# EAGLE schematic SAI_IO_Top_BOARD (EAGLE 9.6.2)
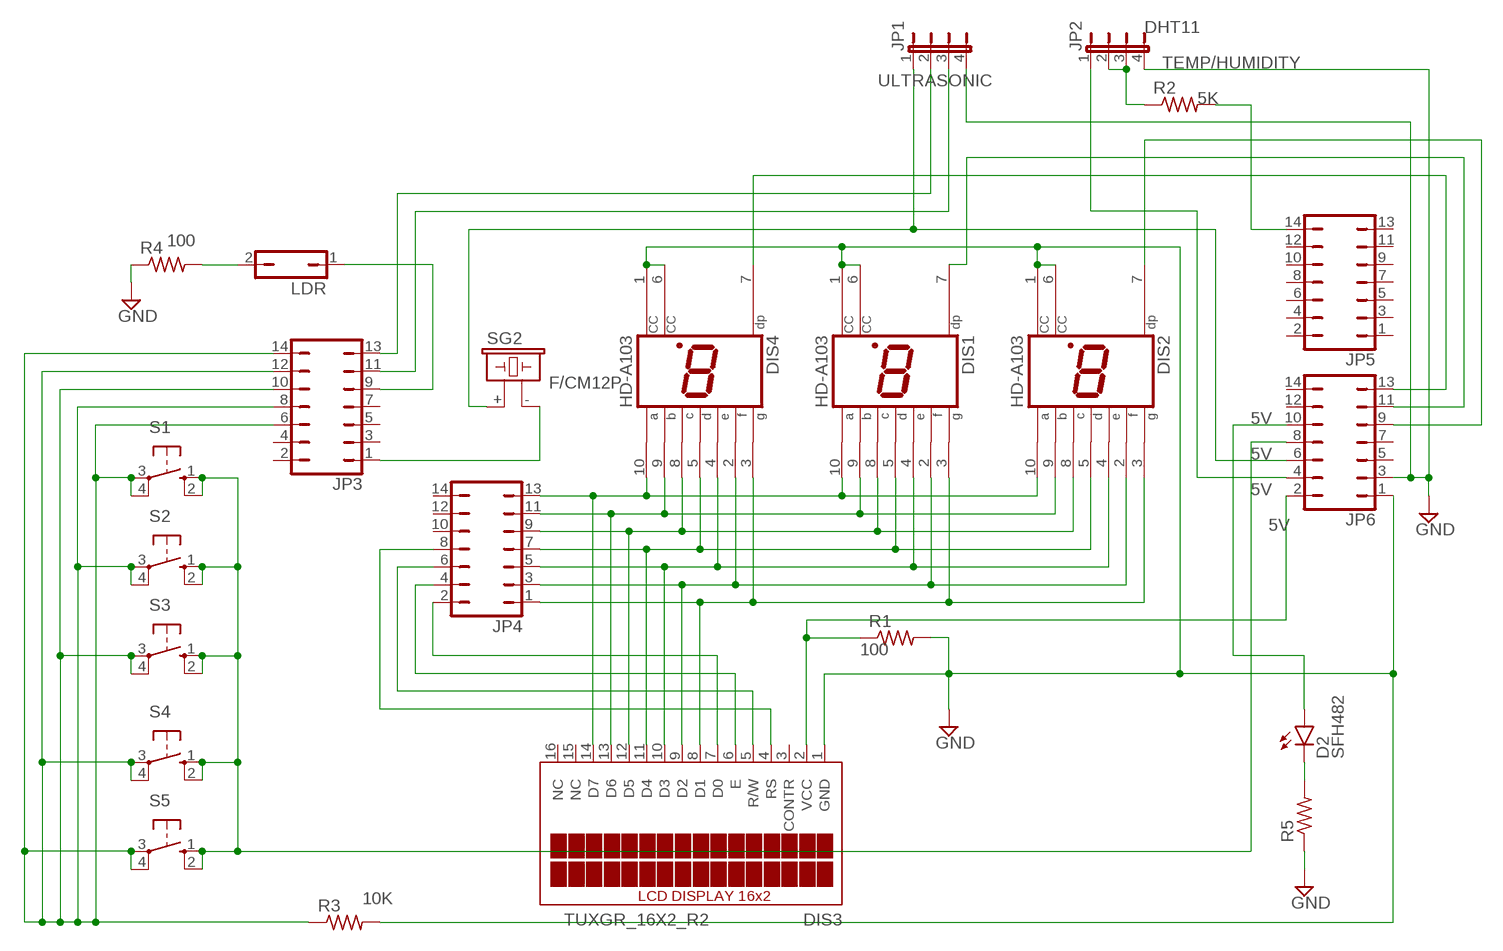
[diagram p0: schematic, sheet 1]

## Parts
D2  SFH482  [SFH482]
DIS1  HD-A103  [HDSP-A]
DIS2  HD-A103  [HDSP-A]
DIS3  TUXGR_16X2_R2  [TUXGR_16X2_R2]
DIS4  HD-A103  [HDSP-A]
JP1  JP4E  [JP4]
JP2  JP4E  [JP4]
JP3  JP7Q  [JP7Q]
JP4  JP7Q  [JP7Q]
JP5  JP7Q  [JP7Q]
JP6  JP7Q  [JP7Q]
LDR  JP1Q  [JP1]
R1  R-US_0204/2V  [0204V]
R2  R-US_0204/2V  [0204V]
R3  R-US_0204/2V  [0204V]
R4  R-US_0204/2V  [0204V]
R5  R-US_0204/2V  [0204V]
S1  10-XX  [B3F-10XX]
S2  10-XX  [B3F-10XX]
S3  10-XX  [B3F-10XX]
S4  10-XX  [B3F-10XX]
S5  10-XX  [B3F-10XX]
SG2  F/CM12P  [F/CM12P]

## Nets
5V: JP1.1 JP6.6 SG2.+
GND: DIS1.1(CC) DIS1.6(CC) DIS2.1(CC) DIS2.6(CC) DIS3.1(GND) DIS4.1(CC) DIS4.6(CC) JP1.4 JP2.4 JP6.1 JP6.3 R1.2 R3.2 R4.1 R5.1
N$1: JP3.1 SG2.-
N$2: JP2.2 JP2.3 R2.1
N$3: DIS1.3(G) DIS2.3(G) DIS3.8(D1) DIS4.3(G) JP4.1
N$4: DIS1.2(F) DIS2.2(F) DIS3.9(D2) DIS4.2(F) JP4.3
N$5: DIS1.4(E) DIS2.4(E) DIS3.10(D3) DIS4.4(E) JP4.5
N$6: DIS1.5(D) DIS2.5(D) DIS3.11(D4) DIS4.5(D) JP4.7
N$7: DIS1.8(C) DIS2.8(C) DIS3.12(D5) DIS4.8(C) JP4.9
N$8: DIS1.9(B) DIS2.9(B) DIS3.13(D6) DIS4.9(B) JP4.11
N$9: DIS1.10(A) DIS2.10(A) DIS3.14(D7) DIS4.10(A) JP4.13
N$10: DIS3.7(D0) JP4.2
N$11: DIS3.2(VCC) JP6.2 R1.1
N$12: JP1.3 JP3.11
N$13: DIS3.6(E) JP4.4
N$14: DIS3.5(R/W) JP4.6
N$15: DIS3.4(RS) JP4.8
N$16: JP3.6 JP3.8 JP3.10 JP3.12 JP3.14 R3.1 S1.3(P) S1.4(P1) S2.3(P) S2.4(P1) S3.3(P) S3.4(P1) S4.3(P) S4.4(P1) S5.3(P) S5.4(P1)
N$17: JP1.2 JP3.13
N$18: JP5.14 R2.2
N$19: JP3.9 LDR.1
N$20: LDR.2 R4.2
N$21: JP2.1 JP6.4
N$22: JP6.8 S1.1(S) S1.2(S1) S2.1(S) S2.2(S1) S3.1(S) S3.2(S1) S4.1(S) S4.2(S1) S5.1(S) S5.2(S1)
N$23: D2.K(C) R5.2
N$24: D2.A JP6.10
N$25: DIS4.7(DP) JP6.13
N$26: DIS1.7(DP) JP6.11
N$27: DIS2.7(DP) JP6.9
Unconnected: DIS3.3(CONTR) DIS3.15(NC) DIS3.16(NC) JP3.2 JP3.3 JP3.4 JP3.5 JP3.7 JP4.10 JP4.12 JP4.14 JP5.1 JP5.2 JP5.3 JP5.4 JP5.5 JP5.6 JP5.7 JP5.8 JP5.9 JP5.10 JP5.11 JP5.12 JP5.13 JP6.5 JP6.7 JP6.12 JP6.14

## Notes on the sheet
- DHT11
- TEMP/HUMIDITY
- ULTRASONIC
- 5K
- 100
- 100
- 10K

## Library data of the parts
D2 = led:SFH482: IR LED infrared emitting diode, Infineon
DIS1 DIS2 DIS4 = display-hp:HD-A103: LED DISPLAY 1-character 7 segment, decimal point right; OC_FARNELL: unknown; OC_NEWARK: unknown
DIS3 = display-lcd:TUXGR_16X2_R2: Tuxgraphics LCD display 16x2 characters reflective, without background light Source: tuxgr_12x2_r2.pdf; OC_FARNELL: unknown; OC_NEWARK: unknown
JP1 JP2 = jumper:JP4E: JUMPER
JP3-JP6 = jumper:JP7Q: JUMPER
LDR = jumper:JP1Q: JUMPER
R1-R5 = rcl:R-US_: RESISTOR, American symbol; SPICEPREFIX: R
S1-S5 = switch-omron:10-XX: OMRON SWITCH; MPN: B3F-1000; OC_FARNELL: 176432; OC_NEWARK: 36M3542
SG2 = buzzer:F/CM12P: BUZZER Source: Buerklin; OC_FARNELL: unknown; OC_NEWARK: unknown